# Altium schematic sheet 最小系统板第二版.SchDoc
size A4; SheetNumber: 1; SheetTotal: 1
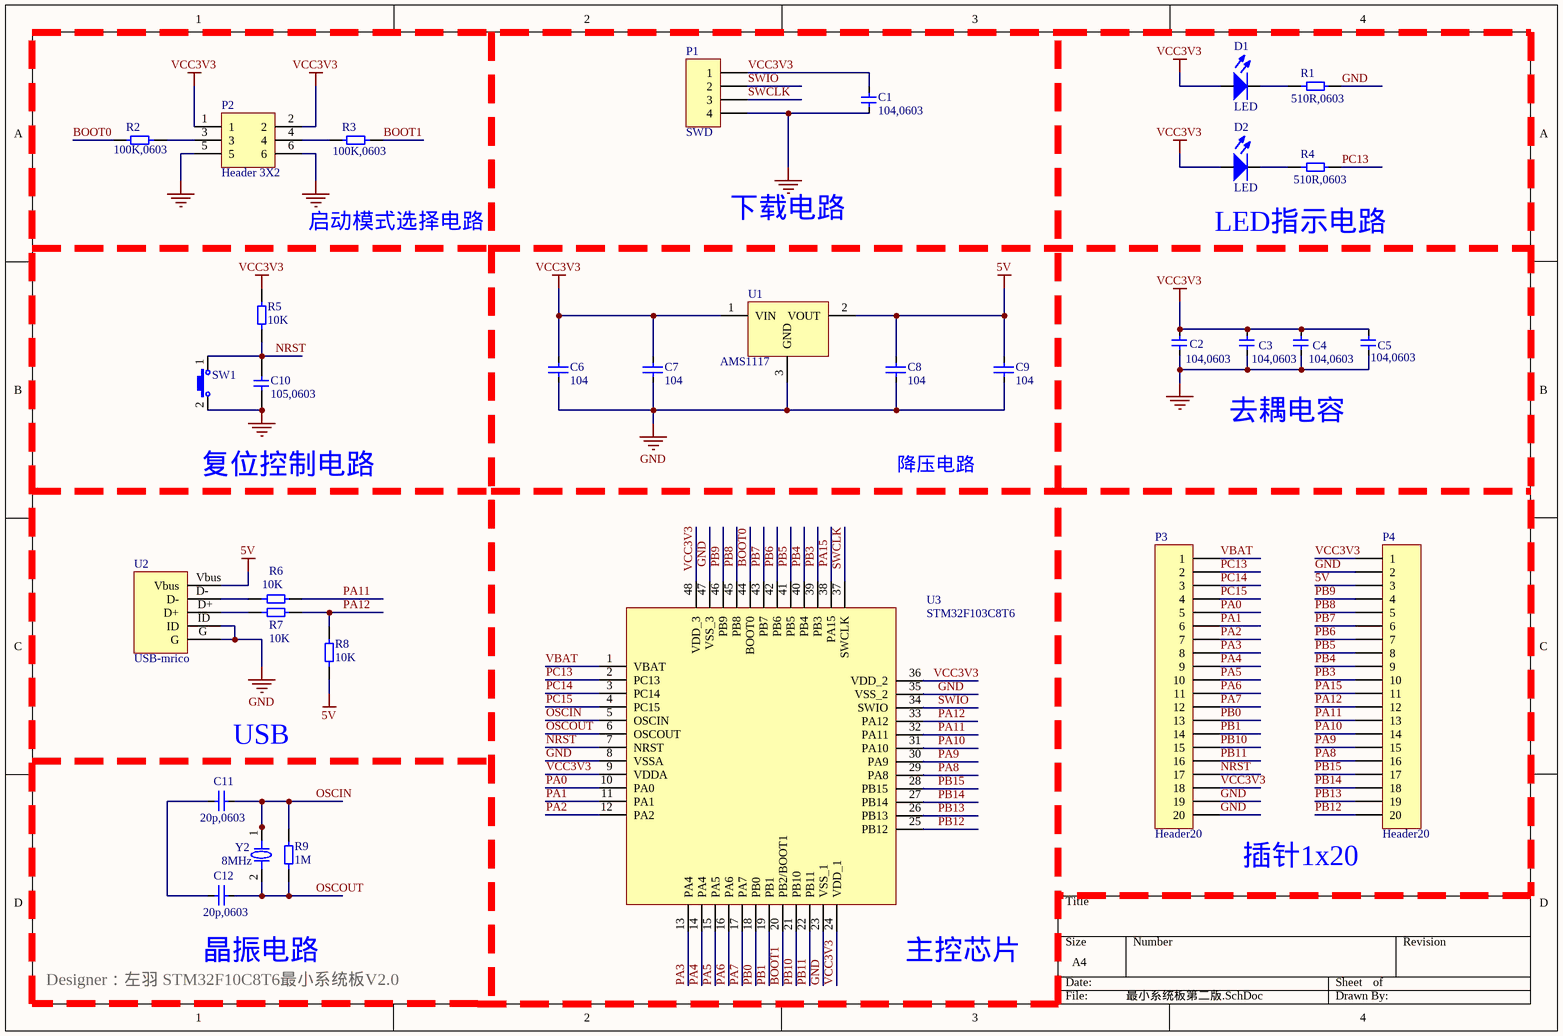
[diagram p0: 最小系统板第二版.SchDoc]

## Parts
C1  104,0603  [0603C]
C2  104,0603  [0603C]
C3  104,0603  [0603C]
C4  104,0603  [0603C]
C5  104,0603  [0603C]
C6  104  [0603C]
C7  104  [0603C]
C8  104  [0603C]
C9  104  [0603C]
C10  105,0603  [0603C]
C11  20p,0603  [0603C]
C12  20p,0603  [0603C]
D1  LED  [LED-0805B]
D2  LED  [LED-0805B]
P1  SWD  [HDR2.54-WI-4P]
P2  Header 3X2  [Pin HDR2X3/2.54mm-S]
P3  Header20  [Pin HDR1X20/2.54mm-S]
P4  Header20  [Pin HDR1X20/2.54mm-S]
R1  510R,0603  [0603R]
R2  100K,0603  [0603R]
R3  100K,0603  [0603R]
R4  510R,0603  [0603R]
R5  10K  [0603R]
R6  10K  [0603R]
R7  10K  [0603R]
R8  10K  [0603R]
R9  1M  [0603R]
SW1  KEY  [复位开关]  (value not drawn)
U1  AMS1117  [SOT-223_L6.5-W3.5-P2.30-LS7.0-BR]
U2  USB-mrico  [PCBComponent_1 - duplicate]
U3  STM32F103C8T6  [LQFP-48_M]
Y2  8MHz  [直插外部晶振]

## Nets
5V: C8.1 C9.1 P4.3 R8.2 U1.2(VOUT) U2.1(Vbus)
GND: C1.2 C2.2 C3.2 C4.2 C5.2 C6.1 C7.2 C8.2 C9.2 C10.2 P1.4 P2.5 P2.6 P3.19 P3.20 P4.2 R1.1 SW1.2 U1.3(GND) U2.4(ID) U2.5(G) U3.8(VSSA) U3.23(VSS_1) U3.35(VSS_2) U3.47(VSS_3)
VCC3V3: C1.1 C2.1 C3.1 C4.1 C5.1 C6.2 C7.1 D1.A D2.A P1.1 P2.1 P2.2 P3.18 P4.1 R5.1 U1.1(VIN) U3.9(VDDA) U3.24(VDD_1) U3.36(VDD_2) U3.48(VDD_3)
BOOT0: R2.1 U3.44(BOOT0)
BOOT1: R3.2 U3.20(PB2/BOOT1)
NRST: C10.1 P3.17 R5.2 SW1.1 U3.7(NRST)
OSCIN: C11.1 R9.1 U3.5(OSCIN) Y2.1
OSCOUT: C12.1 R9.2 U3.6(OSCOUT) Y2.2
PA0: P3.5 U3.10(PA0)
PA1: P3.6 U3.11(PA1)
PA2: P3.7 U3.12(PA2)
PA3: P3.8 U3.13(PA4)
PA4: P3.9 U3.14(PA4)
PA5: P3.10 U3.15(PA5)
PA6: P3.11 U3.16(PA6)
PA7: P3.12 U3.17(PA7)
PA8: P4.16 U3.29(PA8)
PA9: P4.15 U3.30(PA9)
PA10: P4.14 U3.31(PA10)
PA11: P4.13 R6.1 U3.32(PA11)
PA12: P4.12 R7.1 R8.1 U3.33(PA12)
PA15: P4.11 U3.38(PA15)
PB0: P3.13 U3.18(PB0)
PB1: P3.14 U3.19(PB1)
PB3: P4.10 U3.39(PB3)
PB4: P4.9 U3.40(PB4)
PB5: P4.8 U3.41(PB5)
PB6: P4.7 U3.42(PB6)
PB7: P4.6 U3.43(PB7)
PB8: P4.5 U3.45(PB8)
PB9: P4.4 U3.46(PB9)
PB10: P3.15 U3.21(PB10)
PB11: P3.16 U3.22(PB11)
PB12: P4.20 U3.25(PB12)
PB13: P4.19 U3.26(PB13)
PB14: P4.18 U3.27(PB14)
PB15: P4.17 U3.28(PB15)
PC13: P3.2 R4.1 U3.2(PC13)
PC14: P3.3 U3.3(PC14)
PC15: P3.4 U3.4(PC15)
SWCLK: P1.3 U3.37(SWCLK)
SWIO: P1.2 U3.34(SWIO)
VBAT: P3.1 U3.1(VBAT)
NetC11_2: C11.2 C12.2
NetD1_K: D1.K R1.2
NetD2_K: D2.K R4.2
NetP2_3: P2.3 R2.2
NetP2_4: P2.4 R3.1
NetR6_2: R6.2 U2.2(D-)
NetR7_2: R7.2 U2.3(D+)

## Notes on the sheet
- 启动模式选择电路
- 下载电路
- LED指示电路
- 去耦电容
- 复位控制电路
- 降压电路
- USB
- 插针1x20
- Designer：左羽 STM32F10C8T6最小系统板V2.0
- (near C12) 晶振电路
- (near U3) 主控芯片

## Library data of the parts
C1-C12 = CAP: 电容
D1 D2 = LED: LED灯
R1-R9 = RES: 电阻
SW1 = RST: 按键
U1 = AMS1117 3V3
U3 = MCU
Y2 = Crystal oscillator: 晶振